# EAGLE design MVFD_I2C_Backpack (EAGLE 6.2)
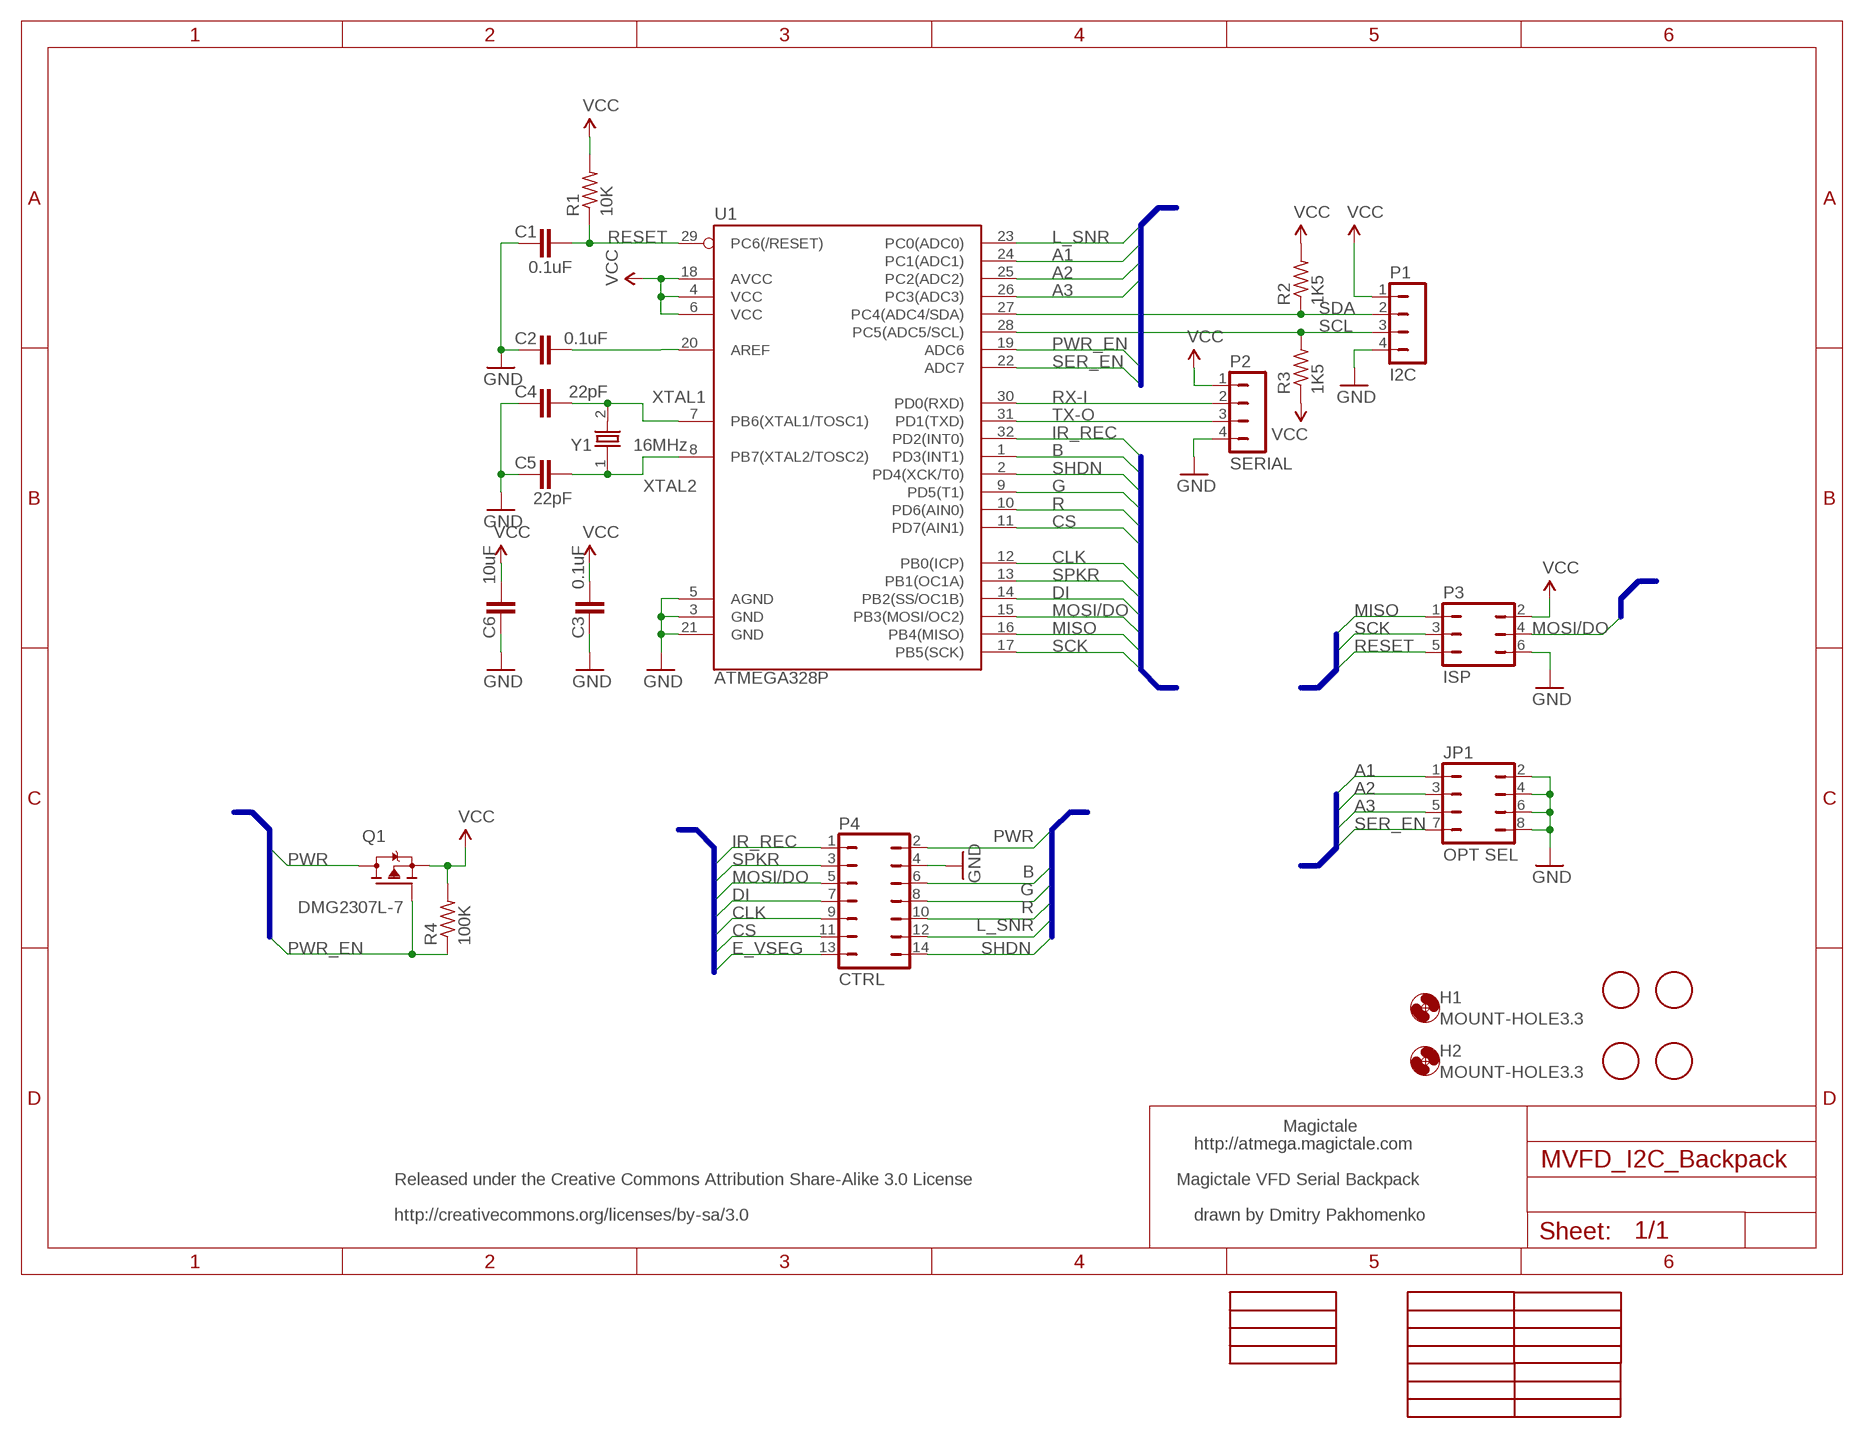
[diagram p0: schematic, sheet 1]

## Parts
C1  0.1uF  CAPACITOR_NPOL-1206  [C1206]
C2  0.1uF  CAPACITOR_NPOL-1206  [C1206]
C3  0.1uF  CAPACITOR_NPOL-1206  [C1206]
C4  22pF  CAPACITOR_NPOL-1206  [C1206]
C5  22pF  CAPACITOR_NPOL-1206  [C1206]
C6  10uF  CAPACITOR_NPOL-1206  [C1206]
FIDUTIAL1  FIDUCIAL  [FIDUCIAL_1MM]
FIDUTIAL2  FIDUCIAL  [FIDUCIAL_1MM]
FIDUTIAL3  FIDUCIAL  [FIDUCIAL_1MM]
FIDUTIAL4  FIDUCIAL  [FIDUCIAL_1MM]
H1  MOUNT-HOLE3.3  [3,3]
H2  MOUNT-HOLE3.3  [3,3]
JP1  OPT SEL  CONN_HEADER_2X04  [CONN_HEADER_2X04]
P1  I2C  CONN_HEADER_1X04RA_POLAR  [CONN_HEADER_1X04_RA_POLAR]
P2  SERIAL  CONN_HEADER_1X04RA_POLAR  [CONN_HEADER_1X04_RA_POLAR]
P3  ISP  CONN_HEADER_2X03  [CONN_HEADER_2X03]
P4  CTRL  CONN_HEADER_2X07F_MIRR  [CONN_HEADER_2X07_F_MIRR]
Q1  DMG2307L-7  TRANSISTOR_FET_TSM2301CX  [SOT-23]
R1  10K  RESISTOR-1206  [R1206]
R2  1K5  RESISTOR-1206  [R1206]
R3  1K5  RESISTOR-1206  [R1206]
R4  100K  RESISTOR-1206  [R1206]
U1  ATMEGA328P  ATMEGA168  [TQFP32-08]
U$1  MT_LOGO  [MT_LOGO]
U$2  HDR_7P2R_DESCR  [HDR_7P2R_DESCR]
U$4  JUMP_4X2_DESCR  [JUMP_4X2_DESCR]
Y1  16MHz  OSC-XTAL-HC-49U-SMD  [HC-49U]

## Nets
A1: JP1.1 U1.24(PC1(ADC1))
A2: JP1.3 U1.25(PC2(ADC2))
A3: JP1.5 U1.26(PC3(ADC3))
AREF: C2.2 U1.20(AREF)
B: P4.6 U1.1(PD3(INT1))
CLK: P4.9 U1.12(PB0(ICP))
CS: P4.11 U1.11(PD7(AIN1))
DI: P4.7 U1.14(PB2(SS/OC1B))
E_VSEG: P4.13
G: P4.8 U1.9(PD5(T1))
GND [power]: C1.1 C2.1 C3.1 C4.1 C5.1 C6.1 JP1.2 JP1.4 JP1.6 JP1.8 P1.4 P2.4 P3.6 P4.4 U1.3(GND) U1.5(AGND) U1.21(GND)
IR_REC: P4.1 U1.32(PD2(INT0))
L_SNR: P4.12 U1.23(PC0(ADC0))
MISO: P3.1 U1.16(PB4(MISO))
MOSI/DO: P3.4 P4.5 U1.15(PB3(MOSI/OC2))
PWR: P4.2 Q1.3(D)
PWR_EN: Q1.1(G) R4.1 U1.19(ADC6)
R: P4.10 U1.10(PD6(AIN0))
RESET: C1.2 P3.5 R1.1 U1.29(PC6(/RESET))
RX-I: P2.2 U1.30(PD0(RXD))
SCK: P3.3 U1.17(PB5(SCK))
SCL: P1.3 R3.2 U1.28(PC5(ADC5/SCL))
SDA: P1.2 R2.1 U1.27(PC4(ADC4/SDA))
SER_EN: JP1.7 U1.22(ADC7)
SHDN: P4.14 U1.2(PD4(XCK/T0))
SPKR: P4.3 U1.13(PB1(OC1A))
TX-O: P2.3 U1.31(PD1(TXD))
VCC: C3.2 C6.2 P1.1 P2.1 P3.2 Q1.2(S) R1.2 R2.2 R3.1 R4.2 U1.4(VCC) U1.6(VCC) U1.18(AVCC)
XTAL1: C4.2 U1.7(PB6(XTAL1/TOSC1)) Y1.2
XTAL2: C5.2 U1.8(PB7(XTAL2/TOSC2)) Y1.1

## Buses
CTRLBUS:R,G,B,SPKR,L_SNR,IR_REC,SPKR,DO,DI,CLK,CS,E_VSEG,SHDN,VS_MIN,VS_MID,VS_MAX,E_VSEG,VEE,G[1..12],S[1..16],K0,K1,PWR
CTRLBUS:IR_REC,B,SHDN,G,R,CS,CLK,SPKR,DI,MOSI/DO,MISO,SCK
CTRLBUS:L_SNR,A1,A2,A3,SER_EN,PWR_EN
CTRLBUS:MOSI/DO
CTRLBUS:MISO,SCK,RESET
CTRLBUS:A1,A2,A3,SER_EN
CTRLBUS:R,G,B,SPKR,L_SNR,IR_REC,SPKR,MOSI/DO,DI,CLK,CS,E_VSEG,SHDN,VS_MIN,VS_MID,VS_MAX,E_VSEG,VEE,G[1..12],S[1..16],K0,K1
CTRLBUS:PWR,PWR_EN

## Notes on the sheet
- Magictale
- http://atmega.magictale.com
- Released under the Creative Commons Attribution Share-Alike 3.0 License | Magictale VFD Serial Backpack
- http://creativecommons.org/licenses/by-sa/3.0 | drawn by Dmitry Pakhomenko

## Library data of the parts
C1-C3 = magictale:CAPACITOR_NPOL: Non-Polarized capacitor in various packages; DIGIKEY: 445-14296-1-ND
C4 C5 = magictale:CAPACITOR_NPOL: Non-Polarized capacitor in various packages; DIGIKEY: 399-8165-1-ND
C6 = magictale:CAPACITOR_NPOL: Non-Polarized capacitor in various packages; DIGIKEY: 399-1299-1-ND
FIDUTIAL1-FIDUTIAL4 = adafruit:FIDUCIAL: For use by pick and place machines to calibrate the vision/machine, 1mm By microbuilder.eu
H1 H2 = holes:MOUNT-HOLE: MOUNTING HOLE with drill center marker
JP1 = magictale:CONN_HEADER_2X04: 2.54 2x4 Header; DIGIKEY: 609-3226-ND
P1 P2 = magictale:CONN_HEADER_1X04: 2.54 1x4 Header; DIGIKEY: 732-2701-ND
P3 = magictale:CONN_HEADER_2X03: 2.54 2x3 Header; DIGIKEY: 3M9459-ND
P4 = magictale:CONN_HEADER_2X07: JUMPER; DIGIKEY: S7075-ND
Q1 = dp_devices:TRANSISTOR_FET_TSM2301CX: 20V P-Channel Enhancement Mode MOSFET; DIGIKEY: DMG2307L-7DICT-ND
R1 = magictale:RESISTOR; DIGIKEY: RHM10KZCT-ND
R2 R3 = magictale:RESISTOR; DIGIKEY: RHM1.50KYCT-ND
R4 = magictale:RESISTOR; DIGIKEY: RHM100KYCT-ND
U1 = SparkFun:ATMEGA168; DIGIKEY: ATMEGA328P-AU-ND
U$1 = magictale:MT_LOGO; LICENSE: CC3.0; PCBREV: REV 1.0, 2013.09.28; PROJECT: MVFD Serial Backpack; URL: http://atmega.magictale.com
U$2 = magictale:HDR_7P2R_DESCR; P1: IR_REC; P10: R; P11: CS; P12: L_SNR; P13: VSEG; P14: SHDN; P2: +5V; P3: SPKR; P4: GND; P5: DO; P6: B; P7: DI; P8: G; P9: CLK
U$4 = magictale:JUMP_4X2_DESCR; OPT1: A1; OPT2: A2; OPT3: A3; OPT4: SER_EN
Y1 = magictale:OSC-XTAL; DIGIKEY: 887-1059-1-ND

## Net classes
0 default: width 0.203 mm, drill 0.305 mm, clearance 0.152 mm
1 power: width 0.406 mm, drill 0.508 mm, clearance 0.203 mm

## Board
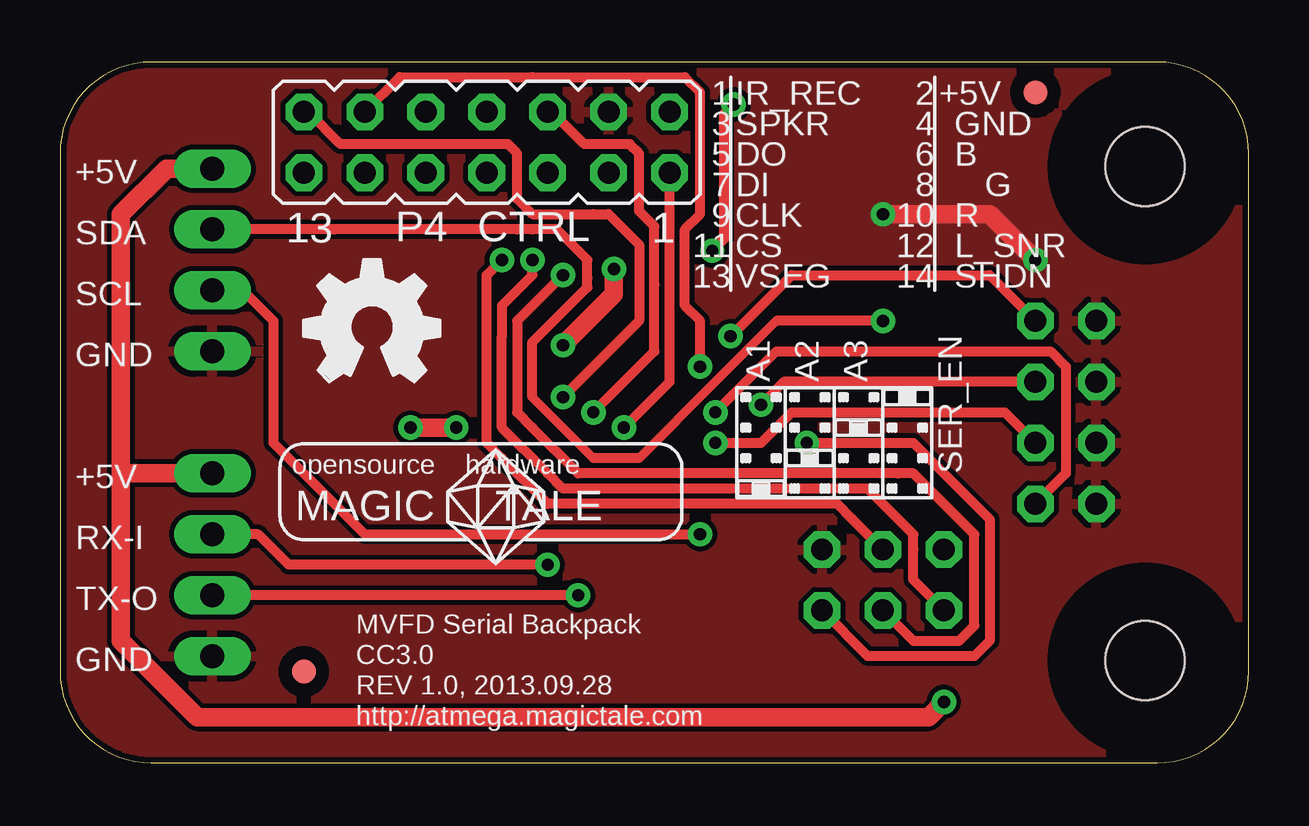
[diagram p1: board, top side]
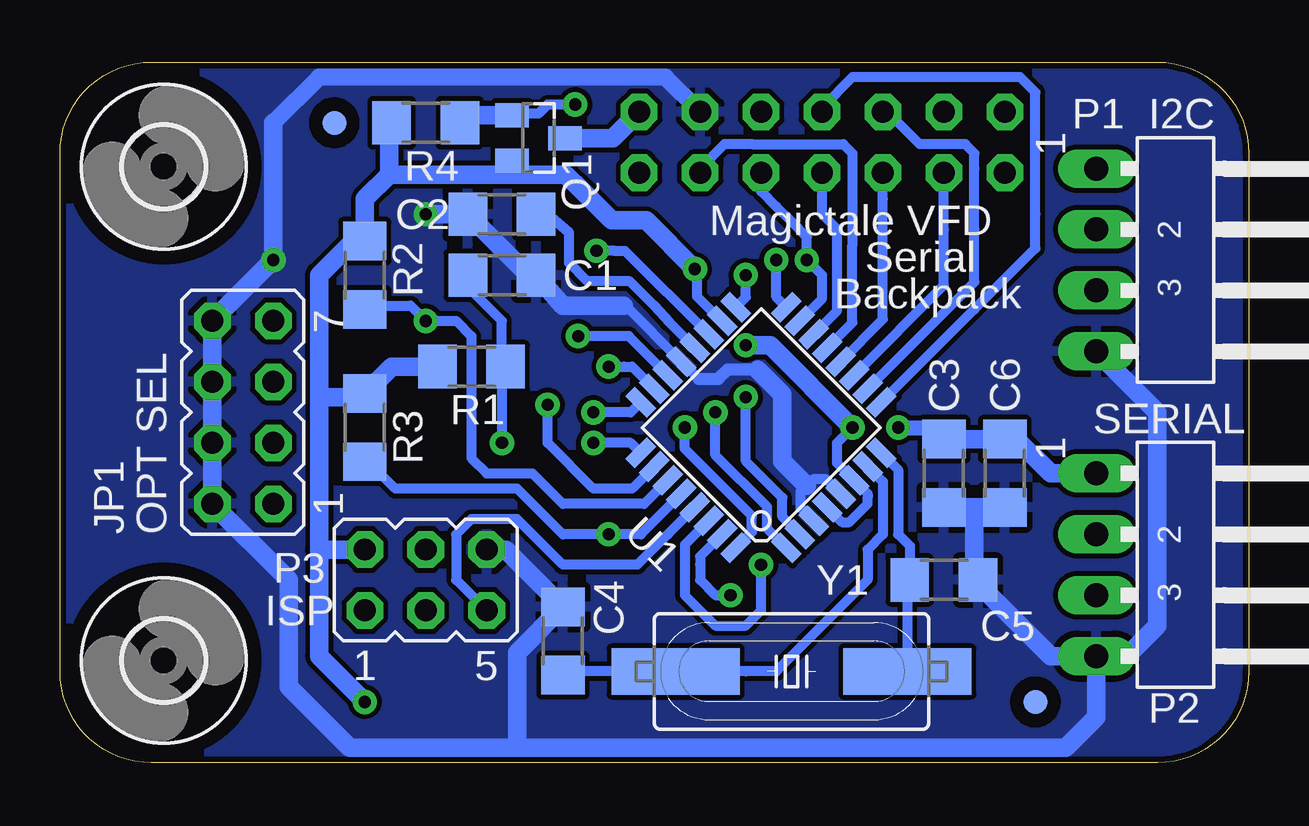
[diagram p2: board, bottom side, seen from below]

Size 49.53 x 29.2 mm. Coordinates in mm from the lower left corner, seen from the top.
Outline: 0,25.39 0,3.81 arc90 3.81,0 45.72,0 arc90 49.53,3.81 49.53,25.39 arc90 45.72,29.2 3.81,29.2 arc90 0,25.39
Copper layers (1*16): Top 0.035mm / dielectric 1.5mm / Bottom 0.035mm
Design rules: minimum track width 8mil, minimum drill 20mil, track to track 8mil, track to pad 8mil, pad to pad 8mil, via to via 8mil, smd to smd 8mil, copper to edge 10mil, drill to drill 8mil, minimum pad ring 12mil, minimum via ring 10mil, stop-mask expansion 4mil, vias tented up to drill 25mil, thermal gap 10mil

### Footprints (pad centres in the part's own frame; a part is rotated, then mirrored left to right if it is on the bottom)
C1206 = smd 1.6 x 1.803: 1 -1.422,0; 2 1.422,0
FIDUCIAL_1MM = smd 1 x 1: 1 0,0
3,3 = hole 3.3: 0,0
CONN_HEADER_2X04 = drill 0.914 octagon: 1 -3.81,-1.27; 2 -3.81,1.27; 3 -1.27,-1.27; 4 -1.27,1.27; 5 1.27,-1.27; 6 1.27,1.27; 7 3.81,-1.27; 8 3.81,1.27
CONN_HEADER_1X04_RA_POLAR = drill 1 long: 1 -3.81,-2.54; 2 -1.27,-2.54; 3 1.27,-2.54; 4 3.81,-2.54
CONN_HEADER_2X03 = drill 0.914 octagon: 1 -2.54,-1.27; 2 -2.54,1.27; 3 0,-1.27; 4 0,1.27; 5 2.54,-1.27; 6 2.54,1.27
CONN_HEADER_2X07_F_MIRR = drill 0.914 octagon: 1 -7.62,-1.27; 2 -7.62,1.27; 3 -5.08,-1.27; 4 -5.08,1.27; 5 -2.54,-1.27; 6 -2.54,1.27; 7 0,-1.27; 8 0,1.27; 9 2.54,-1.27; 10 2.54,1.27; 11 5.08,-1.27; 12 5.08,1.27; 13 7.62,-1.27; 14 7.62,1.27
SOT-23 = smd 1 x 1.4: 1 -0.95,-1.1; 2 0.95,-1.1; 3 0,1.1
R1206 = smd 1.6 x 1.803: 1 -1.422,0; 2 1.422,0
TQFP32-08 = smd 1.27 x 0.559: 1 -4.293,2.8; 2 -4.293,2; 3 -4.293,1.2; 4 -4.293,0.4; 5 -4.293,-0.4; 6 -4.293,-1.2; 7 -4.293,-2; 8 -4.293,-2.8; 17 4.293,-2.8; 18 4.293,-2; 19 4.293,-1.2; 20 4.293,-0.4; 21 4.293,0.4; 22 4.293,1.2; 23 4.293,2; 24 4.293,2.8 | smd 0.559 x 1.27: 9 -2.8,-4.293; 10 -2,-4.293; 11 -1.2,-4.293; 12 -0.4,-4.293; 13 0.4,-4.293; 14 1.2,-4.293; 15 2,-4.293; 16 2.8,-4.293; 25 2.8,4.293; 26 2,4.293; 27 1.2,4.293; 28 0.4,4.293; 29 -0.4,4.293; 30 -1.2,4.293; 31 -2,4.293; 32 -2.8,4.293
HC-49U = smd 5.334 x 1.93: 1 -4.826,0; 2 4.826,0

### Placement (x,y rotation side)
C1  31.12,20.32 180 bottom
C2  31.12,22.86 0 bottom
C3  12.7,12.06 90 bottom
C4  28.58,5.08 270 bottom
C5  12.7,7.62 180 bottom
C6  10.16,12.06 90 bottom
FIDUTIAL1  38.1,26.67 0 bottom
FIDUTIAL2  8.89,2.54 0 bottom
FIDUTIAL3  40.64,27.94 0 top
FIDUTIAL4  10.16,3.81 0 top
H1  45.21,24.84 0 bottom
H2  45.21,4.27 0 bottom
JP1  41.91,14.61 90 bottom
P1  3.81,20.95 270 bottom
P2  3.81,8.26 270 bottom
P3  34.29,7.62 0 bottom
P4  17.78,25.86 0 bottom
Q1  29.59,26.04 270 bottom
R1  32.39,16.51 180 bottom
R2  36.83,20.32 90 bottom
R3  36.83,13.97 270 bottom
R4  34.29,26.67 180 bottom
U1  20.32,13.97 135 bottom
U$1  18.42,10.79 0 top
U$2  35.56,23.5 0 top
U$3  [LOGO_OSHW_FILLX200_NOTEXT]  10.16,15.88 0 top
U$4  32.39,17.14 90 top
Y1  19.05,3.81 180 bottom

### Tracks (layer width: path | path; a pad name or v marks a point on that pad's centre or on a via)
A1  (via drill 0.51)
  Top 0.406: v27.31,14.61 29.84,17.14 38.73,17.14 40.64,17.14 41.28,17.14 41.91,16.51 41.91,12.06 JP1.1
  Bottom 0.406: U1.24 25.76,14.61 v27.31,14.61
A2  (via drill 0.51)
  Top 0.406: v27.31,13.34 29.21,13.34 30.48,14.61 39.37,14.61 JP1.3
  Bottom 0.406: U1.25 25.76,13.34 v27.31,13.34
A3  (via drill 0.51)
  Top 0.406: JP1.5 30.16,15.88 v29.21,14.92
  Bottom 0.406: U1.26 25.69,11.43 27.31,11.43 29.21,13.34 v29.21,14.92
AREF
  Bottom 0.406: 29.28,23.5 C2.2 | 29.69,22.64 C2.2 | U1.20 24.13,18.35 24.77,19.05 25.78,20.07 27.56,20.07 28.32,20.83 28.32,22.1 29.21,22.86 C2.2
B  (via drill 0.51)
  Top 0.406: P4.6 20.5,27.13 21.84,25.78 23.75,25.78 24.13,25.4 24.13,24.77 24.13,22.99 24.77,22.35 24.77,19.94 24.77,17.14 v22.23,14.61
  Bottom 0.406: U1.1 20.07,9.76 20.07,10.67 22.23,12.83 v22.23,14.61
CLK
  Bottom 0.406: U1.12 15.24,18.48 15.24,23.5 15.24,24.13 P4.9
CS
  Bottom 0.406: U1.11 12.7,19.89 12.7,22.23 P4.11
DI
  Bottom 0.406: U1.14 17.14,18.84 17.14,22.23 17.78,22.86 P4.7
G
  Bottom 0.406: U1.9 11.43,18.9 8.89,21.44 8.89,22.86 8.89,27.94 9.53,28.57 10.8,28.57 12.07,28.57 16.51,28.57 17.78,27.3 P4.8
GND  (via drill 0.51)
  Top 0.762: v34.29,22.86 38.73,22.86 v40.64,20.95
  Bottom 0.406: U1.3 18.67,10.62 18.67,11.3 18.42,11.56 18.16,11.81 17.59,11.81 U1.5 | 26.03,19.05 25.97,19.05 U1.21 22.92,16
  Bottom 0.508: 20.45,16.38 21.72,16.38 22.1,16 22.92,16
  Bottom 0.711: P4.4 24.31,28.57 26.67,28.57 38.73,28.57 40.64,26.67
  Bottom 0.762: P1.4 3.81,14.61 3.81,5.71 5.08,4.45 P2.4 | 40.64,26.67 v40.64,20.95 JP1.8 JP1.6 JP1.4 JP1.2 40.01,7.62 40.01,3.17 37.47,0.64 30.48,0.64 | 26.03,19.05 28.58,19.05 C1.1 30,20.32 C2.1 33.81,22.86 v34.29,22.86 | 30.48,0.64 7.62,0.64 6.35,1.91 P2.4 | P2.4 8.26,4.45 11.28,7.47 C5.1 11.43,7.77 11.43,10.64 | 31.75,8.74 P3.6 30.96,8.89 C4.1 30.48,4.6 30.48,0.64 | C6.1 11.43,10.64 | 11.43,10.64 C3.1 | 20.45,16.38 19.43,15.37 19.43,12.57 18.42,11.56
  pour Top: 0,29.21 0,0 49.53,0 49.53,29.21
  pour Bottom: 0,29.21 0,0 49.53,0 49.53,29.21
IR_REC  (via drill 0.51)
  Top 0.406: v23.5,13.97 25.4,15.88 P4.1
  Bottom 0.406: U1.32 20.95,9.38 20.7,9.63 20.7,10.29 23.5,13.08 v23.5,13.97
L_SNR  (via drill 0.51)
  Top 0.406: P4.12 14.15,28.57 19.69,28.57 26.03,28.57 26.67,27.94 26.67,22.86 26.03,22.23 26.03,19.05 26.67,18.41 v26.67,16.51
  Bottom 0.406: U1.23 25.69,16.51 26.03,16.51 v26.67,16.51
MISO  (via drill 0.51)
  Top 0.406: P3.1 35.56,7.62 35.56,8.89 35.56,9.53 33.66,11.43 20.95,11.43 20.32,12.06 18.42,13.97 18.42,17.78 18.42,19.05 19.69,20.32 v19.69,20.95
  Bottom 0.406: U1.16 19.69,19.41 v19.69,20.95
MOSI/DO  (via drill 0.51)
  Top 0.406: P3.4 33.02,10.16 32.39,10.79 20.32,10.79 18.42,12.7 17.78,13.34 17.78,20.32 v18.42,20.95
  Bottom 0.406: U1.15 17.78,19.34 17.78,20.32 v18.42,20.95 18.42,21.91 19.05,22.54 19.69,23.18 20.32,23.81 P4.5
PWR
  Bottom 0.762: Q1.3 26.49,26.04 P4.2
PWR_EN  (via drill 0.51)
  Top 0.406: v27.18,21.34 27.69,21.84 27.69,27.05 v28.07,27.43
  Bottom 0.406: 22.55,17.85 U1.19 25.99,21.34 26.42,21.34 v27.18,21.34 | v28.07,27.43 29.21,27.43 29.46,27.18 29.59,27.05 30.62,27.05 Q1.1
  Bottom 0.762: Q1.1 32.55,26.98 R4.1
R
  Bottom 0.406: U1.10 13.97,17.49 11.43,20.03 11.43,22.23 11.43,24.77 11.43,25.4 11.81,25.78 13.72,25.78 15.06,27.13 P4.10
RESET  (via drill 0.51)
  Top 0.406: v31.12,13.34 35.56,13.34 38.73,10.16 38.73,5.08 38.1,4.45 33.66,4.45 P3.5
  Bottom 0.406: U1.29 24.2,9.53 25.47,8.26 26.03,8.26 28.58,8.26 29.84,9.53 30.48,10.16 31.75,10.16 32.39,10.16 33.02,9.53 33.02,7.62 P3.5 | C1.2 32.39,19.68 31.12,18.41 31.12,16.66 R1.1 31.12,16.36 31.12,14.61 v31.12,13.34
RX-I  (via drill 0.51)
  Top 0.406: v20.32,8.26 9.53,8.26 8.26,9.53 P2.2
  Bottom 0.406: U1.30 23.5,9.1 23.5,6.99 22.23,5.71 20.95,5.71 20.32,6.35 v20.32,8.26
SCK  (via drill 0.51)
  Top 0.406: P3.3 35.56,5.08 37.47,5.08 38.1,5.71 38.1,9.53 35.56,12.06 34.92,12.06 21.59,12.06 19.69,13.97 19.05,14.61 19.05,18.41 v20.95,20.32
  Bottom 0.406: U1.17 20.95,19.41 v20.95,20.32
SCL  (via drill 0.51)
  Top 0.406: P1.3 7.62,19.68 8.89,18.41 8.89,13.34 12.7,9.53 v26.67,9.53
  Bottom 0.406: U1.28 25.33,9.53 v26.67,9.53 28.58,9.53 30.48,11.43 35.56,11.43 36.68,12.55 R3.2
SDA  (via drill 0.51)
  Top 0.356: 29.84,18.41 27.31,15.88 24.13,12.7 | 22.23,12.7 19.69,15.24
  Top 0.406: v34.29,18.41 29.84,18.41 | 24.13,12.7 22.23,12.7 | 19.69,15.24 19.69,17.53 21.97,19.81 21.97,20.19 21.97,20.95 20.7,22.23 19.69,22.23 19.05,22.23 18.42,22.23 11.43,22.23 P1.2
  Bottom 0.406: U1.27 25.19,10.79 28.58,10.79 29.21,11.43 29.84,12.06 31.75,12.06 32.39,12.7 32.39,17.78 33.02,18.41 v34.29,18.41 34.92,19.05 36.68,19.05 R2.1
SER_EN  (via drill 0.51)
  Top 0.406: JP1.7 40.01,19.05 38.73,20.32 30.48,20.32 v27.94,17.78
  Bottom 0.406: U1.22 25.83,17.78 v27.94,17.78
SHDN  (via drill 0.51)
  Top 0.406: P4.14 10.34,27.13 11.68,25.78 18.67,25.78 19.05,25.4 19.05,23.5 19.69,22.86 22.23,22.86 22.86,22.86 24.13,21.59 24.13,18.41 22.86,17.14 22.23,16.51 v20.95,15.24
  Bottom 0.406: U1.2 19.43,10.25 19.43,11.05 20.95,12.57 v20.95,15.24
SPKR
  Bottom 0.406: U1.13 16.51,18.35 16.51,21.59 16.51,25.4 16.89,25.78 20.7,25.78 21.84,25.78 22.86,24.77 P4.3
TX-O  (via drill 0.51)
  Top 0.406: v21.59,6.99 P2.3
  Bottom 0.406: U1.31 22.86,8.6 22.86,8.26 22.86,7.62 22.23,6.99 v21.59,6.99
VCC  (via drill 0.51)
  Top 0.762: P1.1 4.45,24.77 2.54,22.86 2.54,12.06 | 2.54,12.06 2.54,5.08 5.72,1.91 36.2,1.91 v36.83,2.54 | P2.1 2.54,12.06 | v14.61,13.97 v16.51,13.97 | v23.08,20.57 23.08,19.52 v20.95,17.4
  Bottom 0.406: C3.2 13.18,13.97 | 13.34,13.97 13.21,13.97 | U1.4 16.95,10.03 16.64,10.03 16.13,10.54 15.88,10.79 15.88,11.05 15.88,11.22 U1.6 17.14,12.49 17.14,13.21 17.14,13.34 v16.51,13.97 | U1.18 21.98,18.42 22.73,19.18 22.92,19.37 22.99,19.43 22.99,20.48 v23.08,20.57
  Bottom 0.635: 14.35,13.97 v14.61,13.97 14.35,13.97 | 14.35,13.97 13.34,13.97
  Bottom 0.762: R1.2 35.71,16.51 R3.1 36.98,15.24 38.73,15.24 | 38.73,15.24 38.73,8.89 | 38.73,8.89 P3.2 38.1,8.89 | 38.73,15.24 38.73,20.32 37.31,21.74 R2.2 36.83,23.5 35.81,24.51 | P2.1 8.26,12.06 9.68,13.49 C6.2 C3.2 | 38.73,8.89 38.73,4.45 v36.83,2.54 | v20.95,17.4 19.94,17.4 v16.51,13.97 | v23.08,20.57 25.11,22.61 26.54,22.61 27.81,23.88 28.45,24.51 30.73,24.51 | 30.73,24.51 35.81,24.51 | R4.2 35.81,26.57 35.81,24.51 | Q1.2 30.69,24.55 30.73,24.51
XTAL1
  Bottom 0.406: U1.7 15.24,11.72 15.24,10.16 15.24,9.53 15.88,8.89 15.88,7.62 19.69,3.81 20.95,3.81 Y1.2 28.58,3.81 C4.2
XTAL2
  Bottom 0.406: U1.8 14.61,12.21 14.61,9.53 14.12,9.04 C5.2 14.22,7.52 Y1.1

### Text on the board
tNames: +5V | SDA | SCL | GND | +5V | RX-I | TX-O | GND
bNames: Magictale VFD | Serial | Backpack